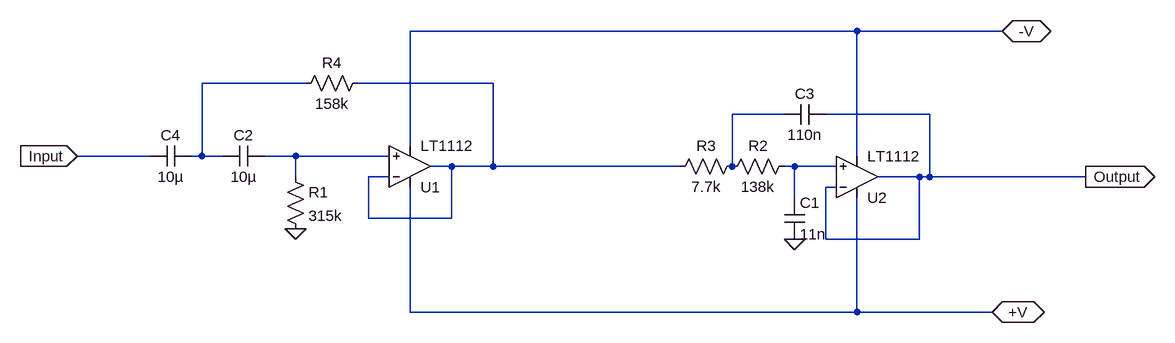
[diagram p0: schematic BandPassFilter.asc]
BandPassFilter.asc, the LTspice schematic file:
Version 4
SHEET 1 1844 680
WIRE 880 -16 192 -16
WIRE 1104 -16 880 -16
WIRE 32 64 -128 64
WIRE 320 64 112 64
WIRE 768 112 688 112
WIRE 992 112 832 112
WIRE 192 160 192 -16
WIRE -208 176 -320 176
WIRE -128 176 -128 64
WIRE -128 176 -144 176
WIRE -96 176 -128 176
WIRE 16 176 -32 176
WIRE 160 176 16 176
WIRE 880 176 880 -16
WIRE 256 192 224 192
WIRE 320 192 320 64
WIRE 320 192 256 192
WIRE 608 192 320 192
WIRE 688 192 688 112
WIRE 784 192 768 192
WIRE 848 192 784 192
WIRE 16 208 16 176
WIRE 160 208 128 208
WIRE 976 208 912 208
WIRE 992 208 992 112
WIRE 992 208 976 208
WIRE 1232 208 992 208
WIRE 848 224 832 224
WIRE 784 240 784 192
WIRE 128 272 128 208
WIRE 256 272 256 192
WIRE 256 272 128 272
WIRE 832 304 832 224
WIRE 976 304 976 208
WIRE 976 304 832 304
WIRE 192 416 192 224
WIRE 880 416 880 240
WIRE 880 416 192 416
WIRE 1088 416 880 416
FLAG -320 176 Input
IOPIN -320 176 In
FLAG 1232 208 Output
IOPIN 1232 208 Out
FLAG 1088 416 +V
IOPIN 1088 416 BiDir
FLAG 1104 -16 -V
IOPIN 1104 -16 BiDir
FLAG 784 304 0
FLAG 16 288 0
SYMBOL Opamps\\LT1112 192 256 M180
SYMATTR InstName U1
SYMBOL Opamps\\LT1112 880 272 M180
SYMATTR InstName U2
SYMBOL res 784 176 R90
WINDOW 0 0 56 VBottom 2
WINDOW 3 32 56 VTop 2
SYMATTR InstName R2
SYMATTR Value 138k
SYMBOL res 704 176 R90
WINDOW 0 0 56 VBottom 2
WINDOW 3 32 56 VTop 2
SYMATTR InstName R3
SYMATTR Value 7.7k
SYMBOL cap 768 240 R0
SYMATTR InstName C1
SYMATTR Value 11n
SYMBOL cap 832 96 R90
WINDOW 0 0 32 VBottom 2
WINDOW 3 32 32 VTop 2
SYMATTR InstName C3
SYMATTR Value 110n
SYMBOL res 0 192 R0
SYMATTR InstName R1
SYMATTR Value 315k
SYMBOL res 128 48 R90
WINDOW 0 0 56 VBottom 2
WINDOW 3 32 56 VTop 2
SYMATTR InstName R4
SYMATTR Value 158k
SYMBOL cap -32 160 R90
WINDOW 0 0 32 VBottom 2
WINDOW 3 32 32 VTop 2
SYMATTR InstName C2
SYMATTR Value 10µ
SYMBOL cap -144 160 R90
WINDOW 0 0 32 VBottom 2
WINDOW 3 32 32 VTop 2
SYMATTR InstName C4
SYMATTR Value 10µ

The netlist it stands for:
* BandPassFilter.asc
XU1 N004 N002 +V -V N002 LT1112  ; pins In+ In- V+ V- OUT
XU2 N005 Output +V -V Output LT1112  ; pins In+ In- V+ V- OUT
R2 N005 N003 138k
R3 N003 N002 7.7k
C1 N005 0 11n
C3 Output N003 110n
R1 N004 0 315k
R4 N002 N001 158k
C2 N004 N001 10µ
C4 N001 Input 10µ
.lib LTC.lib
.backanno
.end